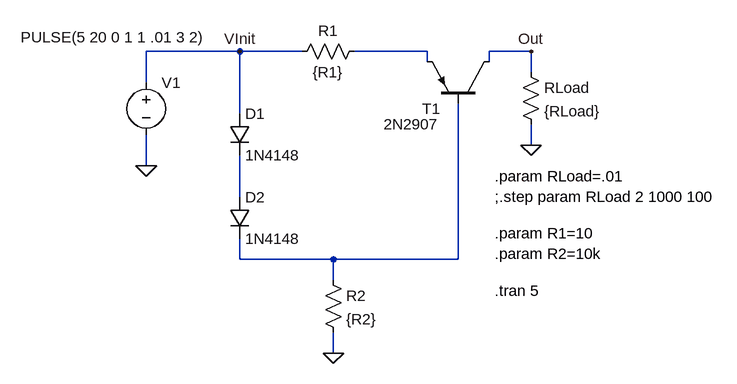
[diagram p0: schematic CurrentLimiter-01.asc]
CurrentLimiter-01.asc, the LTspice schematic file:
Version 4.1
SHEET 1 1172 944
WIRE -160 32 -304 32
WIRE -64 32 -160 32
WIRE 128 32 16 32
WIRE 288 32 224 32
WIRE 128 48 128 32
WIRE 224 48 224 32
WIRE 288 64 288 32
WIRE -304 80 -304 32
WIRE -160 128 -160 32
WIRE 288 176 288 144
WIRE -304 208 -304 160
WIRE -160 256 -160 192
WIRE -160 352 -160 320
WIRE -16 352 -160 352
WIRE 176 352 176 112
WIRE 176 352 -16 352
WIRE -16 384 -16 352
WIRE -16 496 -16 464
FLAG -304 208 0
FLAG 288 176 0
FLAG -16 496 0
FLAG -160 32 VInit
FLAG 288 32 Out
SYMBOL pnp 224 112 M270
WINDOW 0 -8 75 VRight 2
WINDOW 3 -32 78 VRight 2
SYMATTR InstName T1
SYMATTR Value 2N2907
SYMBOL res 32 16 R90
WINDOW 0 0 56 VBottom 2
WINDOW 3 32 56 VTop 2
SYMATTR InstName R1
SYMATTR Value {R1}
SYMBOL voltage -304 64 R0
WINDOW 123 0 0 Left 0
WINDOW 39 0 0 Left 0
WINDOW 3 -193 -54 Left 2
SYMATTR InstName V1
SYMATTR Value PULSE(5 20 0 1 1 .01 3 2)
SYMBOL diode -176 128 R0
SYMATTR InstName D1
SYMATTR Value 1N4148
SYMBOL diode -176 256 R0
SYMATTR InstName D2
SYMATTR Value 1N4148
SYMBOL res -32 368 R0
SYMATTR InstName R2
SYMATTR Value {R2}
SYMBOL res 272 48 R0
SYMATTR InstName RLoad
SYMATTR Value {RLoad}
TEXT 232 312 Left 2 !.param R1=10\n.param R2=10k
TEXT 232 224 Left 2 !.param RLoad=.01\n;.step param RLoad 2 1000 100
TEXT 232 400 Left 2 !.tran 5

The netlist it stands for:
* CurrentLimiter-01.asc
Q§T1 Out N003 N001 0 2N2907
R1 N001 VInit {R1}
V1 VInit 0 PULSE(5 20 0 1 1 .01 3 2)
D1 VInit N002 1N4148
D2 N002 N003 1N4148
R2 N003 0 {R2}
RLoad Out 0 {RLoad}
.model D D
.lib standard.dio
.model NPN NPN
.model PNP PNP
.lib standard.bjt
.param R1=10
.param R2=10k
.param RLoad=.01
;.step param RLoad 2 1000 100
.tran 5
.backanno
.end